# Altium project OpenBMS.PrjPcb (part 1 of 3)
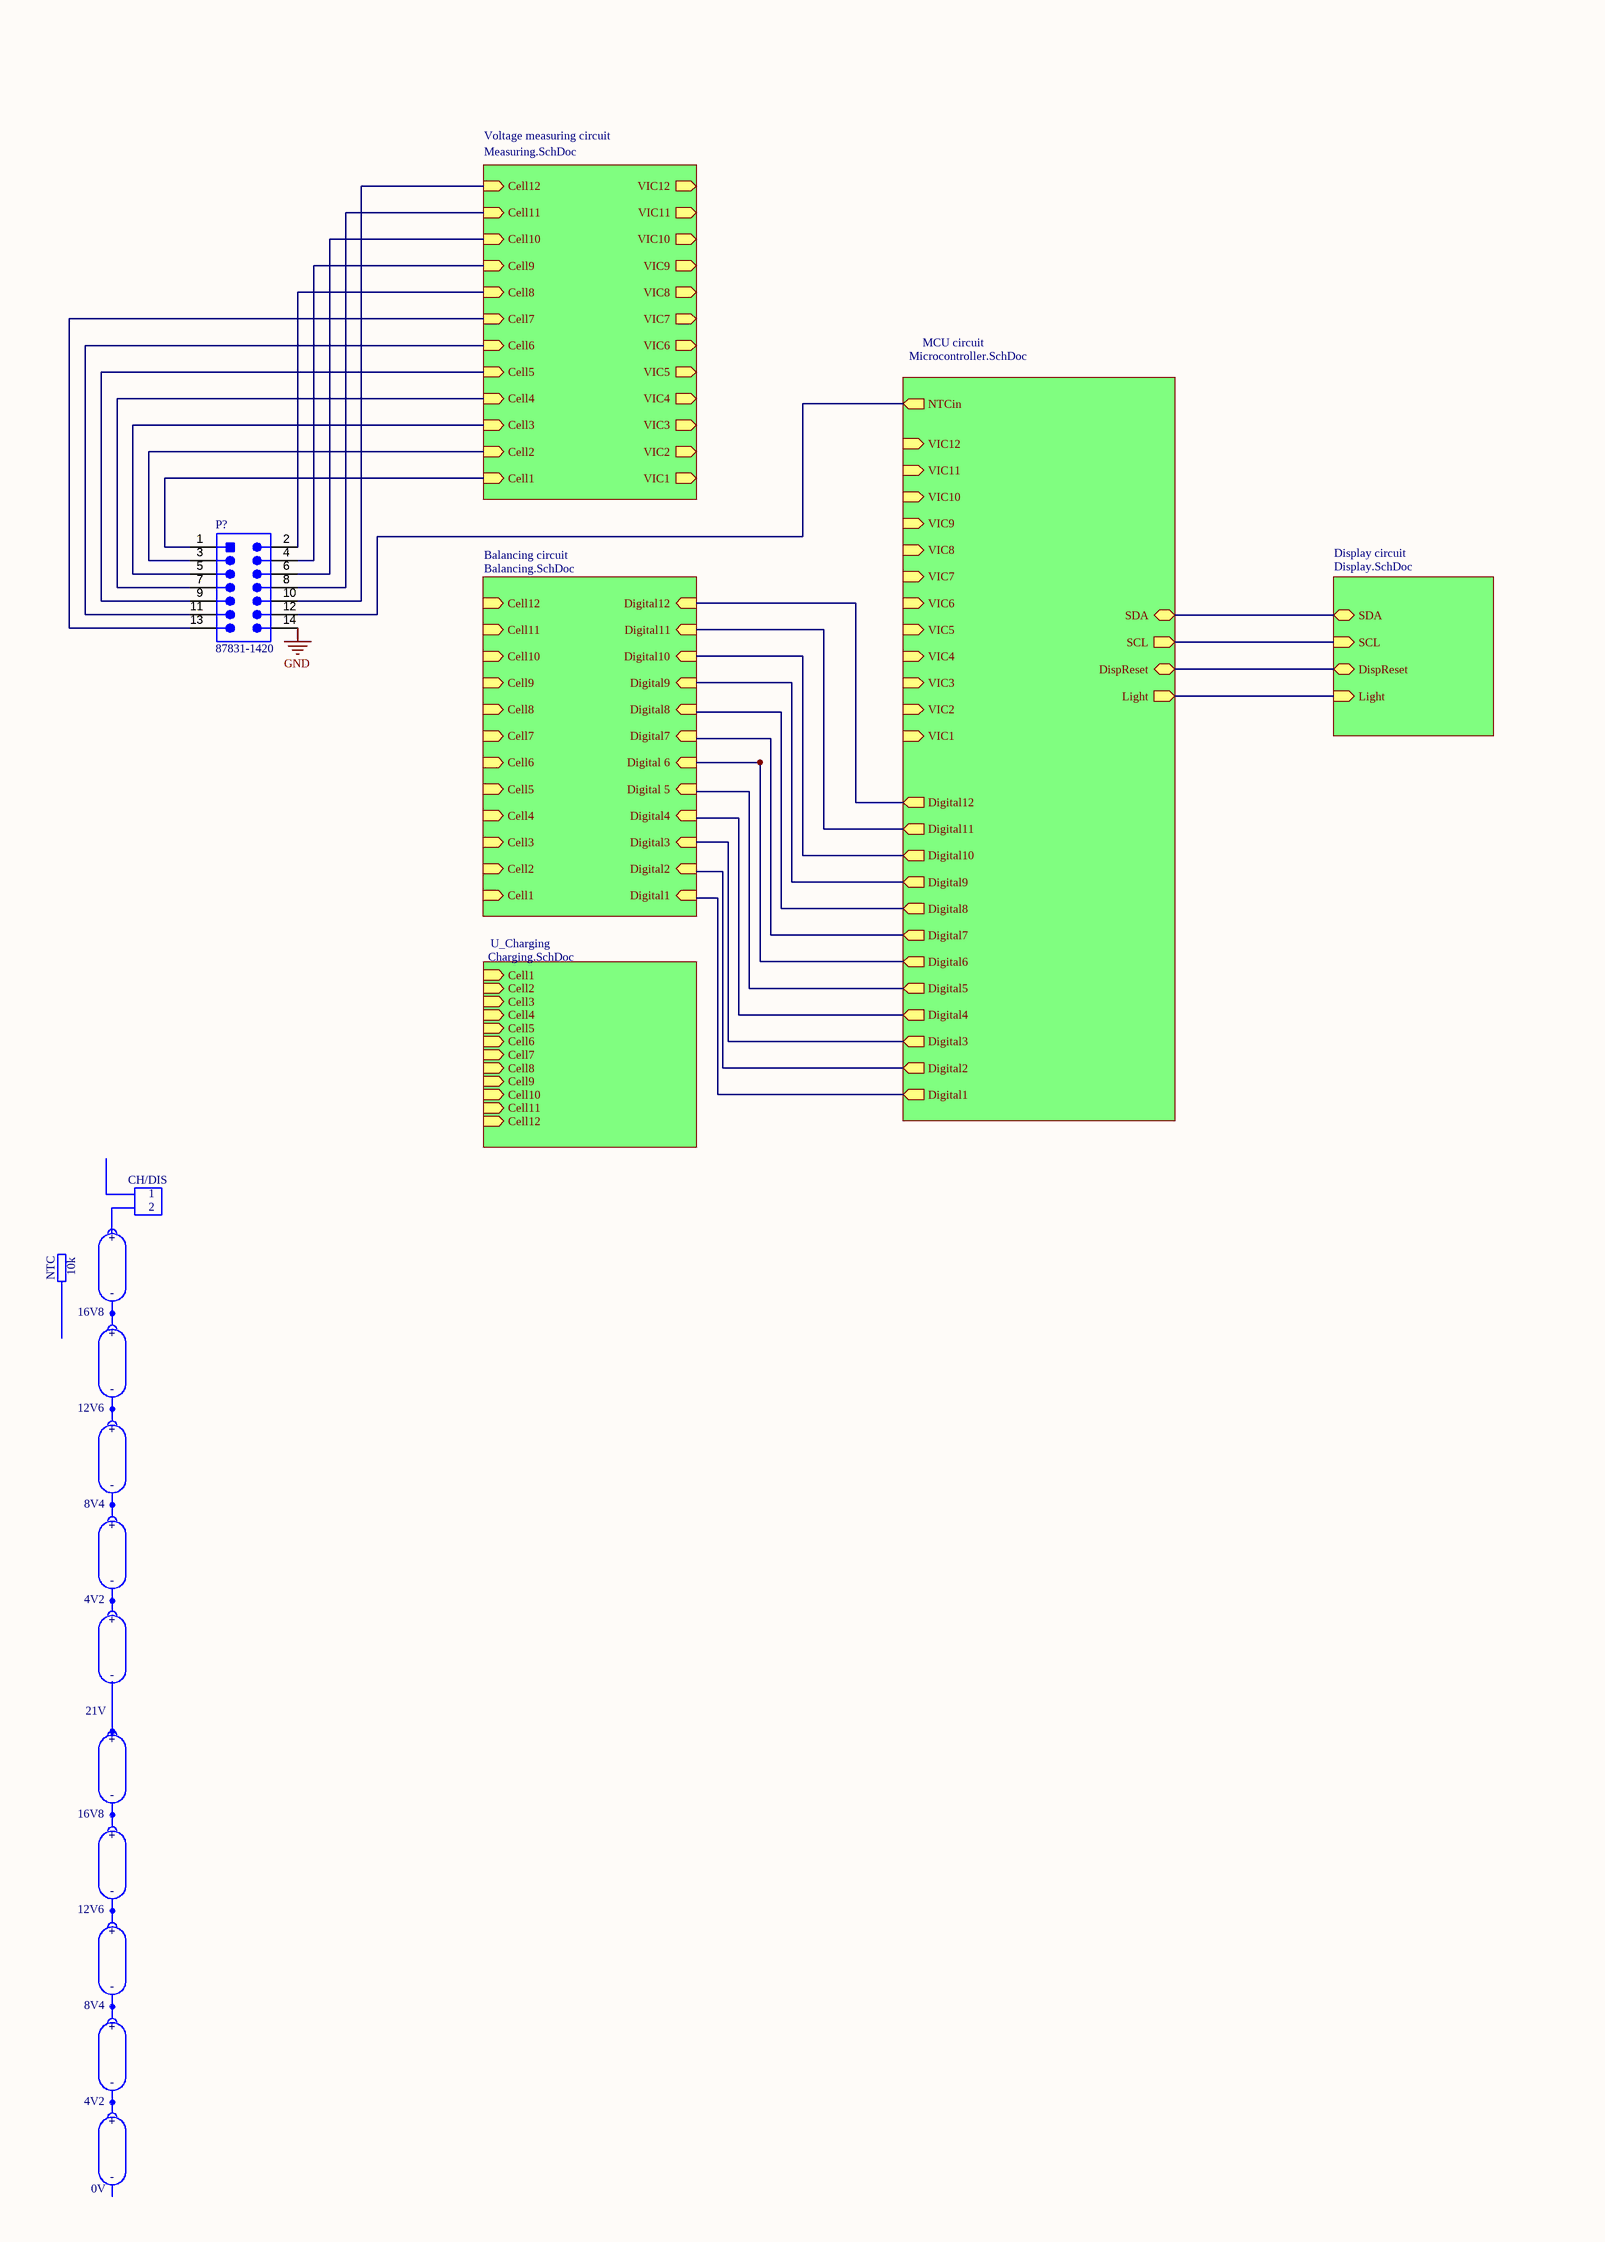
[diagram p0: OpenBMS.SchDoc]
6 sheets, 404 parts. Net scope: hierarchical (ports join the sheet entries above them; power ports are global).
Board file: OpenBMS.PcbDoc
Sheets:
  OpenBMS.SchDoc
    Balancing circuit = Balancing.SchDoc
    Voltage measuring circuit = Measuring.SchDoc
    MCU circuit = Microcontroller.SchDoc
    Display circuit = Display.SchDoc
    U_Charging = Charging.SchDoc

## Sheet OpenBMS.SchDoc: OpenBMS Parent schematic
size 299 x 420 mm; Title2: OpenBMS; Project: OpenBMS; DSN_APP_DATE: --/--/--; CHK_APP_DATE: --/--/--; ApprovedBy: 1; CheckedBy: 1; Author: Kayoum Djedidi; CompanyName: ISIMM; DrawnBy: Kayoum Djedidi; DocumentNumber: 1; Revision: 0; SheetNumber: 1; SheetTotal: 5; ImagePath: 1

### Parts
P?  87831-1420  [MOLEX-87831-1420_V]

### Sub-sheets
Balancing circuit = Balancing.SchDoc: Cell1 (in), Cell2 (in), Cell3 (in), Cell4 (in), Cell5 (in), Digital 5 (in), Digital4 (in), Digital3 (in), Digital2 (in), Digital1 (in), Cell6 (in), Digital 6 (in), Cell7 (in), Digital7 (in), Cell8 (in), Digital8 (in), Cell9 (in), Digital9 (in), Cell10 (in), Digital10 (in), Cell11 (in), Digital11 (in), Cell12 (in), Digital12 (in)
Display circuit = Display.SchDoc: Light (in), DispReset (bidir), SCL (in), SDA (bidir)
MCU circuit = Microcontroller.SchDoc: VIC5 (in), VIC4 (in), VIC3 (in), VIC2 (in), VIC1 (in), Digital5 (out), Digital4 (out), Digital3 (out), Digital2 (out), Digital1 (out), SDA (bidir), SCL (out), DispReset (bidir), Light (out), NTCin (out), Digital10 (out), Digital9 (out), Digital8 (out), Digital7 (out), Digital6 (out), VIC10 (in), VIC9 (in), VIC8 (in), VIC7 (in), VIC6 (in), VIC11 (in), VIC12 (in), Digital11 (out), Digital12 (out)
U_Charging = Charging.SchDoc: Cell1 (in), Cell2 (in), Cell3 (in), Cell4 (in), Cell5 (in), Cell6 (in), Cell7 (in), Cell8 (in), Cell9 (in), Cell10 (in), Cell11 (in), Cell12 (in)
Voltage measuring circuit = Measuring.SchDoc: Cell5 (in), Cell4 (in), Cell3 (in), Cell2 (in), Cell1 (in), VIC5 (out), VIC4 (out), VIC3 (out), VIC2 (out), VIC1 (out), Cell6 (in), VIC6 (out), Cell8 (in), Cell9 (in), Cell10 (in), Cell11 (in), VIC8 (out), VIC9 (out), VIC10 (out), VIC11 (out), Cell7 (in), Cell12 (in), VIC12 (out), VIC7 (out)

### Nets
GND: P?.14
+21V: P?.9 ; sheet Voltage measuring circuit/Cell5
NTCin: P?.12 ; sheet MCU circuit/NTCin
NetDS1_1: sheet MCU circuit/DispReset, sheet Display circuit/DispReset
NetDS1_2: sheet MCU circuit/SCL, sheet Display circuit/SCL
NetDS1_3: sheet MCU circuit/SDA, sheet Display circuit/SDA
NetMCU1_7: sheet Balancing circuit/Digital3, sheet MCU circuit/Digital3
NetMCU1_13: sheet MCU circuit/Light, sheet Display circuit/Light
NetMCU?_5: sheet Balancing circuit/Digital 6, sheet MCU circuit/Digital6
NetMCU?_8: sheet Balancing circuit/Digital9, sheet MCU circuit/Digital9
NetMCU?_9: sheet Balancing circuit/Digital10, sheet MCU circuit/Digital10
NetMCU?_10: sheet Balancing circuit/Digital11, sheet MCU circuit/Digital11
NetMCU?_11: sheet Balancing circuit/Digital12, sheet MCU circuit/Digital12
NetP?_1: P?.1 ; sheet Voltage measuring circuit/Cell1
NetP?_2: P?.2 ; sheet Voltage measuring circuit/Cell8
NetP?_3: P?.3 ; sheet Voltage measuring circuit/Cell2
NetP?_4: P?.4 ; sheet Voltage measuring circuit/Cell9
NetP?_5: P?.5 ; sheet Voltage measuring circuit/Cell3
NetP?_6: P?.6 ; sheet Voltage measuring circuit/Cell10
NetP?_7: P?.7 ; sheet Voltage measuring circuit/Cell4
NetP?_8: P?.8 ; sheet Voltage measuring circuit/Cell11
NetP?_10: P?.10 ; sheet Voltage measuring circuit/Cell12
NetP?_11: P?.11 ; sheet Voltage measuring circuit/Cell6
NetP?_13: P?.13 ; sheet Voltage measuring circuit/Cell7

### Notes on the sheet
- CH/DIS
- +
- 1
- 2
- NTC
- 16V8
- 10k
- -
- 12V6
- 8V4
- 4V2
- 21V
- 0V
- THIS DOCUMENT AND THE DATA DISCLOSED HEREIN OR
- HEREWITH IS THE PROPERTY OF ALTIUM LIMITED AND MAY
- DWG NO:
- REVISION
- REV:
- DESCRIPTION
- DATE
- APPROVED
- BE FREELY DISTRIBUTED IN WHOLE. NO RIGHTS ARE
- RESERVED OR EXPRESS OR IMPLIED WARANTEE GIVEN.
- ENG:
- APPROVALS
- PROJECT
- DSN:
- CHK:
- REFERENCE DOCUMENTS
- PROJECT REVISION:
- TITLE
- DOCUMENT REVISION:
- DESIGN ITEM:
- BOM:
- FAB DWG:
- PCB DWG:
- ASSY DWG:
- SCALE:
- A3
- SIZE
- CAGE CODE
- FILE NAME
- DWG NO.
- SHEET
- OF
- REV

### Library data of the parts
P? = CMP-2000-05240-1: Header, Pitch 2 mm, 2 x 7 Position, Height 6.4 mm, Tail Length 2.5 mm, -55 to 105 degC, RoHS, Tube; Number of Positions / Contacts: 14; Current Rating: 2A; Brand: Molex; Mounting Angle: Vertical; Pitch: 2mm; Voltage Rating: 125V; Datasheet Version: Rev. E, 04/2006; Housing Material: Thermoplastic; Contact Material: Brass; Datasheet URL: https://datasheet.ciiva.com/27096/1934585-27096088.pdf; Type: Shrouded; Number of Positions: 14; Mounting Style: ThroughHole; Product Category: Headers&WireHousings; RoHS: Details; Factory Pack Quantity: 3200; Contact Plating: Gold; Series: 87831; Number of Rows: 2; Manufacturer: Molex; Product Type: Headers; Termination Style: ThroughHole; Packaging: Tube; Tradename: Milli-Grid; Manufacturer URL: http://www.molex.com/

## Sheet Balancing.SchDoc: Cell Balancing
size 420 x 297 mm; ENG_APP_DATE: --/--/--; DSN_APP_DATE: --/--/--; CHK_APP_DATE: --/--/--
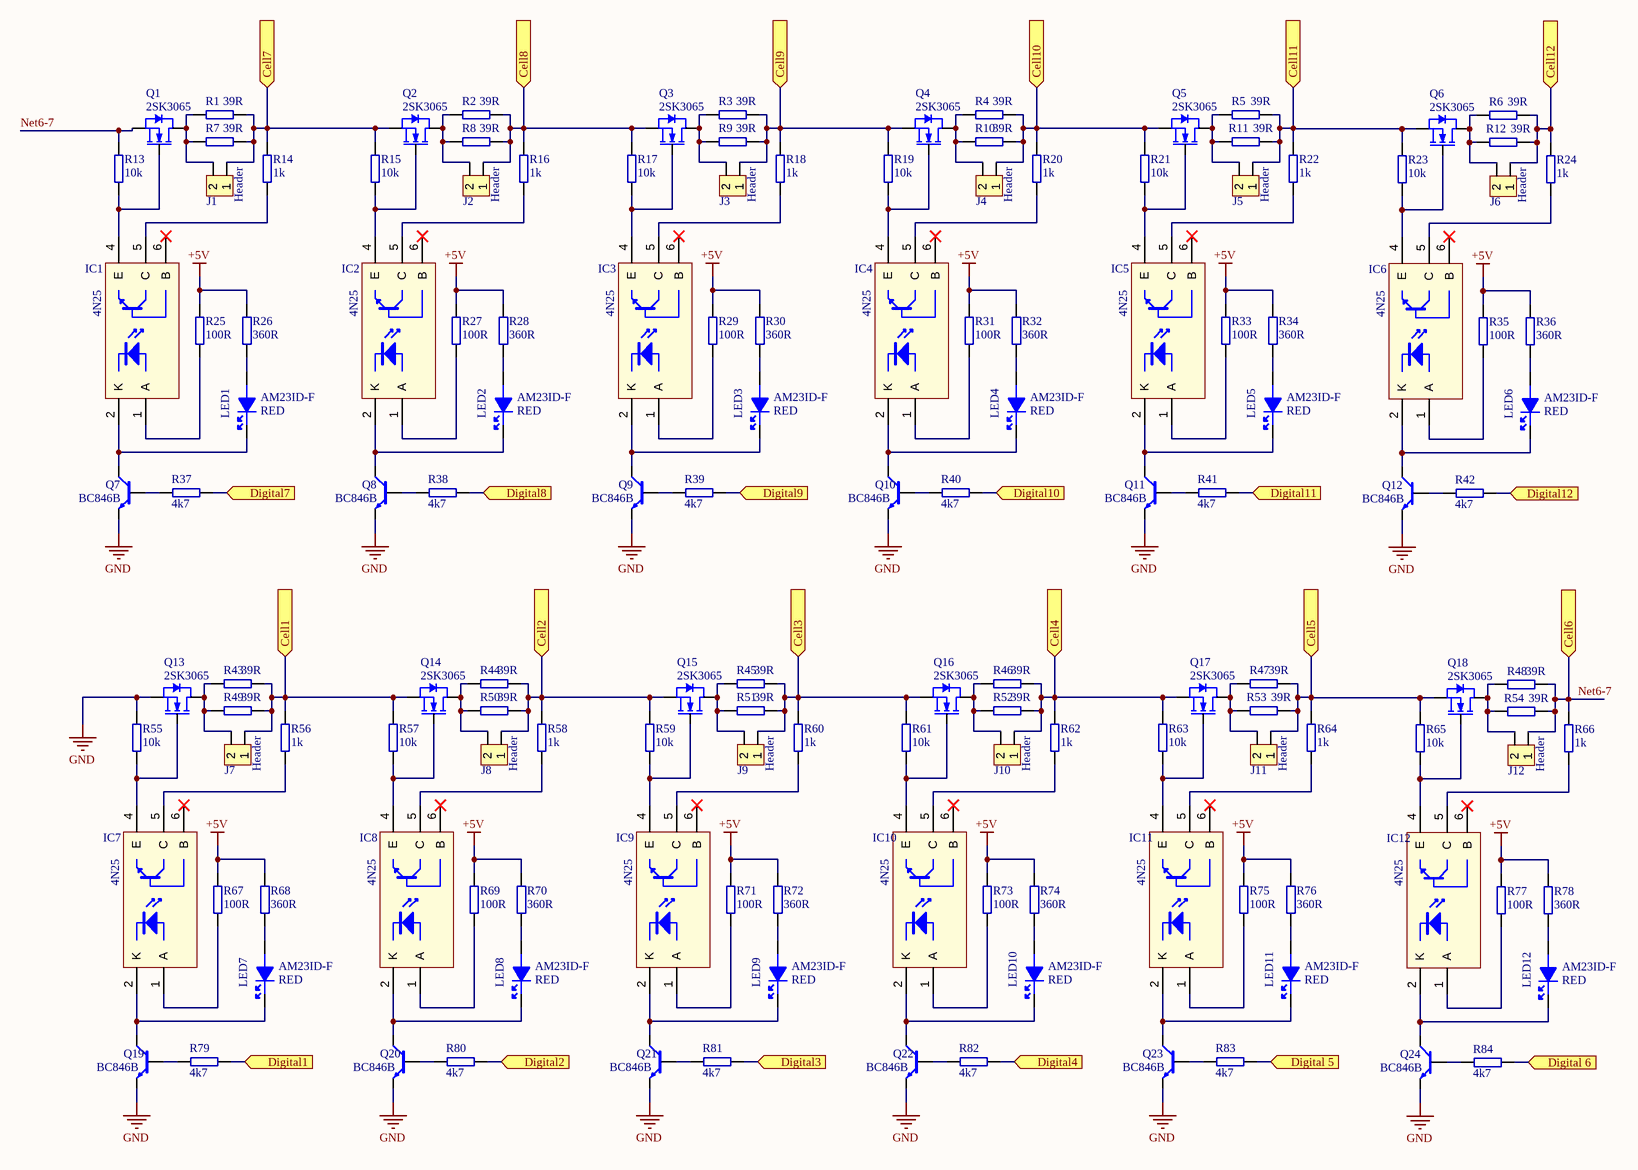
[diagram p1: Balancing.SchDoc]

### Parts
(Parts that share a designator on the sheet are numbered #1, #2 ... from top to bottom, then left to right.)
IC1  Manufacturer Part Number: 4N25  [DIP6]  (hidden comment: 4N25_DIP6)
IC2  Manufacturer Part Number: 4N25  [DIP6]  (hidden comment: 4N25_DIP6)
IC3  Manufacturer Part Number: 4N25  [DIP6]  (hidden comment: 4N25_DIP6)
IC4  Manufacturer Part Number: 4N25  [DIP6]  (hidden comment: 4N25_DIP6)
IC5  Manufacturer Part Number: 4N25  [DIP6]  (hidden comment: 4N25_DIP6)
IC6  Manufacturer Part Number: 4N25  [DIP6]  (hidden comment: 4N25_DIP6)
IC7  Manufacturer Part Number: 4N25  [DIP6]  (hidden comment: 4N25_DIP6)
IC8  Manufacturer Part Number: 4N25  [DIP6]  (hidden comment: 4N25_DIP6)
IC9  Manufacturer Part Number: 4N25  [DIP6]  (hidden comment: 4N25_DIP6)
IC10  Manufacturer Part Number: 4N25  [DIP6]  (hidden comment: 4N25_DIP6)
IC11#1  Manufacturer Part Number: 4N25  [DIP6]  (hidden comment: 4N25_DIP6)
IC12  Manufacturer Part Number: 4N25  [DIP6]  (hidden comment: 4N25_DIP6)
J1  Name: Header  [HDR_1x2_2.54mm-MALE]  (hidden comment: 2.54mm pitch)
J2  Name: Header  [HDR_1x2_2.54mm-MALE]  (hidden comment: 2.54mm pitch)
J3  Name: Header  [HDR_1x2_2.54mm-MALE]  (hidden comment: 2.54mm pitch)
J4  Name: Header  [HDR_1x2_2.54mm-MALE]  (hidden comment: 2.54mm pitch)
J5  Name: Header  [HDR_1x2_2.54mm-MALE]  (hidden comment: 2.54mm pitch)
J6  Name: Header  [HDR_1x2_2.54mm-MALE]  (hidden comment: 2.54mm pitch)
J7  Name: Header  [HDR_1x2_2.54mm-MALE]  (hidden comment: 2.54mm pitch)
J8  Name: Header  [HDR_1x2_2.54mm-MALE]  (hidden comment: 2.54mm pitch)
J9  Name: Header  [HDR_1x2_2.54mm-MALE]  (hidden comment: 2.54mm pitch)
J10  Name: Header  [HDR_1x2_2.54mm-MALE]  (hidden comment: 2.54mm pitch)
J11#1  Name: Header  [HDR_1x2_2.54mm-MALE]  (hidden comment: 2.54mm pitch)
J12#1  Name: Header  [HDR_1x2_2.54mm-MALE]  (hidden comment: 2.54mm pitch)
LED1  Name: RED  Manufacturer Part Number: AM23ID-F  [LED_SOT23]  (hidden comment: LED_SOT23)
LED2  Name: RED  Manufacturer Part Number: AM23ID-F  [LED_SOT23]  (hidden comment: LED_SOT23)
LED3  Name: RED  Manufacturer Part Number: AM23ID-F  [LED_SOT23]  (hidden comment: LED_SOT23)
LED4  Name: RED  Manufacturer Part Number: AM23ID-F  [LED_SOT23]  (hidden comment: LED_SOT23)
LED5  Name: RED  Manufacturer Part Number: AM23ID-F  [LED_SOT23]  (hidden comment: LED_SOT23)
LED6#1  Name: RED  Manufacturer Part Number: AM23ID-F  [LED_SOT23]  (hidden comment: LED_SOT23)
LED7  Name: RED  Manufacturer Part Number: AM23ID-F  [LED_SOT23]  (hidden comment: LED_SOT23)
LED8  Name: RED  Manufacturer Part Number: AM23ID-F  [LED_SOT23]  (hidden comment: LED_SOT23)
LED9  Name: RED  Manufacturer Part Number: AM23ID-F  [LED_SOT23]  (hidden comment: LED_SOT23)
LED10  Name: RED  Manufacturer Part Number: AM23ID-F  [LED_SOT23]  (hidden comment: LED_SOT23)
LED11  Name: RED  Manufacturer Part Number: AM23ID-F  [LED_SOT23]  (hidden comment: LED_SOT23)
LED12  Name: RED  Manufacturer Part Number: AM23ID-F  [LED_SOT23]  (hidden comment: LED_SOT23)
Q1  Name: 2SK3065  [N_MOSFET]  (hidden comment: 2SK3065_SOT89)
Q2  Name: 2SK3065  [N_MOSFET]  (hidden comment: 2SK3065_SOT89)
Q3  Name: 2SK3065  [N_MOSFET]  (hidden comment: 2SK3065_SOT89)
Q4  Name: 2SK3065  [N_MOSFET]  (hidden comment: 2SK3065_SOT89)
Q5  Name: 2SK3065  [N_MOSFET]  (hidden comment: 2SK3065_SOT89)
Q6  Name: 2SK3065  [N_MOSFET]  (hidden comment: 2SK3065_SOT89)
Q7  Name: BC846B  [NPN_BJT_SOT23]  (hidden comment: BC846B_SOT23)
Q8  Name: BC846B  [NPN_BJT_SOT23]  (hidden comment: BC846B_SOT23)
Q9  Name: BC846B  [NPN_BJT_SOT23]  (hidden comment: BC846B_SOT23)
Q10  Name: BC846B  [NPN_BJT_SOT23]  (hidden comment: BC846B_SOT23)
Q11#1  Name: BC846B  [NPN_BJT_SOT23]  (hidden comment: BC846B_SOT23)
Q12  Name: BC846B  [NPN_BJT_SOT23]  (hidden comment: BC846B_SOT23)
Q13  Name: 2SK3065  [N_MOSFET]  (hidden comment: 2SK3065_SOT89)
Q14  Name: 2SK3065  [N_MOSFET]  (hidden comment: 2SK3065_SOT89)
Q15  Name: 2SK3065  [N_MOSFET]  (hidden comment: 2SK3065_SOT89)
Q16  Name: 2SK3065  [N_MOSFET]  (hidden comment: 2SK3065_SOT89)
Q17  Name: 2SK3065  [N_MOSFET]  (hidden comment: 2SK3065_SOT89)
Q18  Name: 2SK3065  [N_MOSFET]  (hidden comment: 2SK3065_SOT89)
Q19  Name: BC846B  [NPN_BJT_SOT23]  (hidden comment: BC846B_SOT23)
Q20  Name: BC846B  [NPN_BJT_SOT23]  (hidden comment: BC846B_SOT23)
Q21  Name: BC846B  [NPN_BJT_SOT23]  (hidden comment: BC846B_SOT23)
Q22  Name: BC846B  [NPN_BJT_SOT23]  (hidden comment: BC846B_SOT23)
Q23  Name: BC846B  [NPN_BJT_SOT23]  (hidden comment: BC846B_SOT23)
Q24  Name: BC846B  [NPN_BJT_SOT23]  (hidden comment: BC846B_SOT23)
R1  Name: 39R  [R_2512]  (hidden comment: 39R_2W)
R2  Name: 39R  [R_2512]  (hidden comment: 39R_2W)
R3  Name: 39R  [R_2512]  (hidden comment: 39R_2W)
R4  Name: 39R  [R_2512]  (hidden comment: 39R_2W)
R5  Name: 39R  [R_2512]  (hidden comment: 39R_2W)
R6  Name: 39R  [R_2512]  (hidden comment: 39R_2W)
R7  Name: 39R  [R_2512]  (hidden comment: 39R_2W)
R8  Name: 39R  [R_2512]  (hidden comment: 39R_2W)
R9  Name: 39R  [R_2512]  (hidden comment: 39R_2W)
R10  Name: 39R  [R_2512]  (hidden comment: 39R_2W)
R11  Name: 39R  [R_2512]  (hidden comment: 39R_2W)
R12  Name: 39R  [R_2512]  (hidden comment: 39R_2W)
R13  Name: 10k  [R_0805]  (hidden comment: 10k_125mW)
R14  Name: 1k  [R_0805]  (hidden comment: 1k_125mW)
R15  Name: 10k  [R_0805]  (hidden comment: 10k_125mW)
R16  Name: 1k  [R_0805]  (hidden comment: 1k_125mW)
R17  Name: 10k  [R_0805]  (hidden comment: 10k_125mW)
R18  Name: 1k  [R_0805]  (hidden comment: 1k_125mW)
R19  Name: 10k  [R_0805]  (hidden comment: 10k_125mW)
R20  Name: 1k  [R_0805]  (hidden comment: 1k_125mW)
R21  Name: 10k  [R_0805]  (hidden comment: 10k_125mW)
R22  Name: 1k  [R_0805]  (hidden comment: 1k_125mW)
R23  Name: 10k  [R_0805]  (hidden comment: 10k_125mW)
R24  Name: 1k  [R_0805]  (hidden comment: 1k_125mW)
R25  Name: 100R  [R_0805]  (hidden comment: 100R_500mW)
R26  Name: 360R  [R_0805]  (hidden comment: 360R_125mW)
R27  Name: 100R  [R_0805]  (hidden comment: 100R_500mW)
R28  Name: 360R  [R_0805]  (hidden comment: 360R_125mW)
R29  Name: 100R  [R_0805]  (hidden comment: 100R_500mW)
R30  Name: 360R  [R_0805]  (hidden comment: 360R_125mW)
R31  Name: 100R  [R_0805]  (hidden comment: 100R_500mW)
R32  Name: 360R  [R_0805]  (hidden comment: 360R_125mW)
R33  Name: 100R  [R_0805]  (hidden comment: 100R_500mW)
R34  Name: 360R  [R_0805]  (hidden comment: 360R_125mW)
R35  Name: 100R  [R_0805]  (hidden comment: 100R_500mW)
R36  Name: 360R  [R_0805]  (hidden comment: 360R_125mW)
R37  Name: 4k7  [R_0805]  (hidden comment: 4k7_125mW)
R38  Name: 4k7  [R_0805]  (hidden comment: 4k7_125mW)
R39  Name: 4k7  [R_0805]  (hidden comment: 4k7_125mW)
R40  Name: 4k7  [R_0805]  (hidden comment: 4k7_125mW)
R41  Name: 4k7  [R_0805]  (hidden comment: 4k7_125mW)
R42  Name: 4k7  [R_0805]  (hidden comment: 4k7_125mW)
R43  Name: 39R  [R_2512]  (hidden comment: 39R_2W)
R44  Name: 39R  [R_2512]  (hidden comment: 39R_2W)
R45  Name: 39R  [R_2512]  (hidden comment: 39R_2W)
R46  Name: 39R  [R_2512]  (hidden comment: 39R_2W)
R47  Name: 39R  [R_2512]  (hidden comment: 39R_2W)
R48  Name: 39R  [R_2512]  (hidden comment: 39R_2W)
R49  Name: 39R  [R_2512]  (hidden comment: 39R_2W)
R50  Name: 39R  [R_2512]  (hidden comment: 39R_2W)
R51  Name: 39R  [R_2512]  (hidden comment: 39R_2W)
R52  Name: 39R  [R_2512]  (hidden comment: 39R_2W)
R53  Name: 39R  [R_2512]  (hidden comment: 39R_2W)
R54  Name: 39R  [R_2512]  (hidden comment: 39R_2W)
R55  Name: 10k  [R_0805]  (hidden comment: 10k_125mW)
R56  Name: 1k  [R_0805]  (hidden comment: 1k_125mW)
R57  Name: 10k  [R_0805]  (hidden comment: 10k_125mW)
R58  Name: 1k  [R_0805]  (hidden comment: 1k_125mW)
R59  Name: 10k  [R_0805]  (hidden comment: 10k_125mW)
R60  Name: 1k  [R_0805]  (hidden comment: 1k_125mW)
R61  Name: 10k  [R_0805]  (hidden comment: 10k_125mW)
R62#1  Name: 1k  [R_0805]  (hidden comment: 1k_125mW)
R63#1  Name: 10k  [R_0805]  (hidden comment: 10k_125mW)
R64#1  Name: 1k  [R_0805]  (hidden comment: 1k_125mW)
R65#1  Name: 10k  [R_0805]  (hidden comment: 10k_125mW)
R66#1  Name: 1k  [R_0805]  (hidden comment: 1k_125mW)
R67#1  Name: 100R  [R_0805]  (hidden comment: 100R_500mW)
R68#1  Name: 360R  [R_0805]  (hidden comment: 360R_125mW)
R69  Name: 100R  [R_0805]  (hidden comment: 100R_500mW)
R70  Name: 360R  [R_0805]  (hidden comment: 360R_125mW)
R71  Name: 100R  [R_0805]  (hidden comment: 100R_500mW)
R72  Name: 360R  [R_0805]  (hidden comment: 360R_125mW)
R73  Name: 100R  [R_0805]  (hidden comment: 100R_500mW)
R74  Name: 360R  [R_0805]  (hidden comment: 360R_125mW)
R75  Name: 100R  [R_0805]  (hidden comment: 100R_500mW)
R76  Name: 360R  [R_0805]  (hidden comment: 360R_125mW)
R77  Name: 100R  [R_0805]  (hidden comment: 100R_500mW)
R78  Name: 360R  [R_0805]  (hidden comment: 360R_125mW)
R79  Name: 4k7  [R_0805]  (hidden comment: 4k7_125mW)
R80  Name: 4k7  [R_0805]  (hidden comment: 4k7_125mW)
R81  Name: 4k7  [R_0805]  (hidden comment: 4k7_125mW)
R82  Name: 4k7  [R_0805]  (hidden comment: 4k7_125mW)
R83  Name: 4k7  [R_0805]  (hidden comment: 4k7_125mW)
R84  Name: 4k7  [R_0805]  (hidden comment: 4k7_125mW)

### Ports
Cell1 (in), Cell2 (in), Cell3 (in), Cell4 (in), Cell5 (in), Cell6 (in), Cell7 (in), Cell8 (in), Cell9 (in), Cell10 (in), Cell11 (in), Cell12 (in), Digital1 (in), Digital2 (in), Digital3 (in), Digital4 (in), Digital7 (in), Digital8 (in), Digital9 (in), Digital10 (in), Digital11 (in), Digital12 (in), Digital 5 (in), Digital 6 (in)

### Nets
+5V: R25.2 R26.1 R27.1 R28.1 R29.1 R30.1 R31.1 R32.1 R33.1 R34.1 R35.1 R36.1 R67#1.2 R68#1.1 R69.1 R70.1 R71.1 R72.1 R73.1 R74.1 R75.1 R76.1 R77.1 R78.1
GND: Q7.3(E) Q8.3(E) Q9.3(E) Q10.3(E) Q11#1.3(E) Q12.3(E) Q13.3(S) Q19.3(E) Q20.3(E) Q21.3(E) Q22.3(E) Q23.3(E) Q24.3(E) R55.1
Net6-7: J12#1.1 Q1.3(S) R13.1 R48.1 R54.1 R66#1.1 ; port Cell6
NetIC1_1: IC1.1(A) R25.1
NetIC1_2: IC1.2(K) LED1.3(K) Q7.1(C)
NetIC1_4: IC1.4(E) Q1.1(G) R13.2
NetIC1_5: IC1.5(C) R14.2
NetIC2_1: IC2.1(A) R27.2
NetIC2_2: IC2.2(K) LED2.3(K) Q8.1(C)
NetIC2_4: IC2.4(E) Q2.1(G) R15.2
NetIC2_5: IC2.5(C) R16.2
NetIC3_1: IC3.1(A) R29.2
NetIC3_2: IC3.2(K) LED3.3(K) Q9.1(C)
NetIC3_4: IC3.4(E) Q3.1(G) R17.2
NetIC3_5: IC3.5(C) R18.2
NetIC4_1: IC4.1(A) R31.2
NetIC4_2: IC4.2(K) LED4.3(K) Q10.1(C)
NetIC4_4: IC4.4(E) Q4.1(G) R19.2
NetIC4_5: IC4.5(C) R20.2
NetIC5_1: IC5.1(A) R33.2
NetIC5_2: IC5.2(K) LED5.3(K) Q11#1.1(C)
NetIC5_4: IC5.4(E) Q5.1(G) R21.2
NetIC5_5: IC5.5(C) R22.2
NetIC6_1: IC6.1(A) R35.2
NetIC6_2: IC6.2(K) LED6#1.3(K) Q12.1(C)
NetIC6_4: IC6.4(E) Q6.1(G) R23.2
NetIC6_5: IC6.5(C) R24.2
NetIC7_1: IC7.1(A) R67#1.1
NetIC7_2: IC7.2(K) LED7.3(K) Q19.1(C)
NetIC7_4: IC7.4(E) Q13.1(G) R55.2
NetIC7_5: IC7.5(C) R56.2
NetIC8_1: IC8.1(A) R69.2
NetIC8_2: IC8.2(K) LED8.3(K) Q20.1(C)
NetIC8_4: IC8.4(E) Q14.1(G) R57.2
NetIC8_5: IC8.5(C) R58.2
NetIC9_1: IC9.1(A) R71.2
NetIC9_2: IC9.2(K) LED9.3(K) Q21.1(C)
NetIC9_4: IC9.4(E) Q15.1(G) R59.2
NetIC9_5: IC9.5(C) R60.2
NetIC10_1: IC10.1(A) R73.2
NetIC10_2: IC10.2(K) LED10.3(K) Q22.1(C)
NetIC10_4: IC10.4(E) Q16.1(G) R61.2
NetIC10_5: IC10.5(C) R62#1.2
NetIC11#1_1: IC11#1.1(A) R75.2
NetIC11#1_2: IC11#1.2(K) LED11.3(K) Q23.1(C)
NetIC11#1_4: IC11#1.4(E) Q17.1(G) R63#1.2
NetIC11#1_5: IC11#1.5(C) R64#1.2
NetIC12_1: IC12.1(A) R77.2
NetIC12_2: IC12.2(K) LED12.3(K) Q24.1(C)
NetIC12_4: IC12.4(E) Q18.1(G) R65#1.2
NetIC12_5: IC12.5(C) R66#1.2
NetJ1_1: J1.1 Q2.3(S) R1.1 R7.1 R14.1 R15.1 ; port Cell7
NetJ1_2: J1.2 Q1.2(D) R1.2 R7.2
NetJ2_1: J2.1 Q3.3(S) R2.1 R8.1 R16.1 R17.1 ; port Cell8
NetJ2_2: J2.2 Q2.2(D) R2.2 R8.2
NetJ3_1: J3.1 Q4.3(S) R3.1 R9.1 R18.1 R19.1 ; port Cell9
NetJ3_2: J3.2 Q3.2(D) R3.2 R9.2
NetJ4_1: J4.1 Q5.3(S) R4.1 R10.1 R20.1 R21.1 ; port Cell10
NetJ4_2: J4.2 Q4.2(D) R4.2 R10.2
NetJ5_1: J5.1 R5.1 R11.1 R22.1 ; port Cell11
NetJ5_2: J5.2 Q5.2(D) R5.2 R11.2
NetJ6_1: J6.1 R6.1 R12.1 R24.1 ; port Cell12
NetJ6_2: J6.2 Q6.2(D) R6.2 R12.2
NetJ7_1: J7.1 Q14.3(S) R43.1 R49.1 R56.1 R57.1 ; port Cell1
NetJ7_2: J7.2 Q13.2(D) R43.2 R49.2
NetJ8_1: J8.1 Q15.3(S) R44.1 R50.1 R58.1 R59.1 ; port Cell2
NetJ8_2: J8.2 Q14.2(D) R44.2 R50.2
NetJ9_1: J9.1 Q16.3(S) R45.1 R51.1 R60.1 R61.1 ; port Cell3
NetJ9_2: J9.2 Q15.2(D) R45.2 R51.2
NetJ10_1: J10.1 Q17.3(S) R46.1 R52.1 R62#1.1 R63#1.1 ; port Cell4
NetJ10_2: J10.2 Q16.2(D) R46.2 R52.2
NetJ11#1_1: J11#1.1 R47.1 R53.1 R64#1.1 ; port Cell5
NetJ11#1_2: J11#1.2 Q17.2(D) R47.2 R53.2
NetJ12#1_2: J12#1.2 Q18.2(D) R48.2 R54.2
NetLED1_1: LED1.1(A) R26.2
NetLED2_1: LED2.1(A) R28.2
NetLED3_1: LED3.1(A) R30.2
NetLED4_1: LED4.1(A) R32.2
NetLED5_1: LED5.1(A) R34.2
NetLED6#1_1: LED6#1.1(A) R36.2
NetLED7_1: LED7.1(A) R68#1.2
NetLED8_1: LED8.1(A) R70.2
NetLED9_1: LED9.1(A) R72.2
NetLED10_1: LED10.1(A) R74.2
NetLED11_1: LED11.1(A) R76.2
NetLED12_1: LED12.1(A) R78.2
NetMCU1_7: R81.2 ; port Digital3
NetMCU?_5: R84.2 ; port Digital 6
NetMCU?_8: R39.2 ; port Digital9
NetMCU?_9: R40.1 ; port Digital10
NetMCU?_10: R41.2 ; port Digital11
NetMCU?_11: R42.2 ; port Digital12
NetQ6_3: Q6.3(S) R23.1
NetQ7_2: Q7.2(B) R37.2
NetQ8_2: Q8.2(B) R38.2
NetQ9_2: Q9.2(B) R39.1
NetQ10_2: Q10.2(B) R40.2
NetQ11#1_2: Q11#1.2(B) R41.1
NetQ12_2: Q12.2(B) R42.1
NetQ18_3: Q18.3(S) R65#1.1
NetQ19_2: Q19.2(B) R79.2
NetQ20_2: Q20.2(B) R80.2
NetQ21_2: Q21.2(B) R81.1
NetQ22_2: Q22.2(B) R82.2
NetQ23_2: Q23.2(B) R83.1
NetQ24_2: Q24.2(B) R84.1
NetR37_1: R37.1 ; port Digital7
NetR38_1: R38.1 ; port Digital8
NetR79_1: R79.1 ; port Digital1
NetR80_1: R80.1 ; port Digital2
NetR82_1: R82.1 ; port Digital4
NetR83_2: R83.2 ; port Digital 5

Not connected (* = marked no-connect by the designer): IC1 6(B)*; IC2 6(B)*; IC3 6(B)*; IC4 6(B)*; IC5 6(B)*; IC6 6(B)*; IC7 6(B)*; IC8 6(B)*; IC9 6(B)*; IC10 6(B)*; IC11#1 6(B)*; IC12 6(B)*

### Notes on the sheet
- THIS DOCUMENT AND THE DATA DISCLOSED HEREIN OR
- HEREWITH IS THE PROPERTY OF ALTIUM LIMITED AND MAY
- DWG NO:
- REVISION
- REV:
- DESCRIPTION
- DATE
- APPROVED
- BE FREELY DISTRIBUTED IN WHOLE. NO RIGHTS ARE
- RESERVED OR EXPRESS OR IMPLIED WARANTEE GIVEN.
- ENG:
- APPROVALS
- PROJECT
- DSN:
- CHK:
- REFERENCE DOCUMENTS
- PROJECT REVISION:
- TITLE
- DOCUMENT REVISION:
- DESIGN ITEM:
- BOM:
- FAB DWG:
- PCB DWG:
- ASSY DWG:
- SCALE:
- A3
- SIZE
- CAGE CODE
- FILE NAME
- DWG NO.
- SHEET
- OF
- REV

### Library data of the parts
IC1-IC10 IC11#1 IC12 = 4N25_DIP6: Optocoupler [TH]; Manufacturer: Vishay Semiconductors; Max Power Dissipation: 150mW; Number of Elements: 1; Collector Emitter Voltage (VCEO): 30V; Rise Time: 2s; Isolation Voltage: 5kV; Forward Voltage: 1.5V; Forward Current: 60mA; Collector Emitter Saturation Voltage: 500mV; Reverse Breakdown Voltage: 5V; Output Voltage: 70V; Output Current per Channel: 50mA; Max Collector Current: 100mA; Current Transfer Ratio: 50%; Approvals: UL; Supplier 1: Mouser; RoHS: Yes; Mount: Through Hole; Case/Package: DIP-6; Number of Pins: 6; Contact Plating: Tin; Min Operating Temperature: -55°C; Max Operating Temperature: 100°C; Packaging: Rail/Tube; Package Quantity: 2000; Power Dissipation: 150mW; Number of Channels: 1; Max Input Current: 60mA; Max Output Voltage: 30V; Fall Time: 2s; Input Current: 50mA; Collector Emitter Breakdown Voltage: 30V; Radiation Hardening: No; Lead Free: Lead Free; REACH SVHC: Unknown; ComponentLink1URL: https://hr.mouser.com/datasheet/2/427/VISHS81804_1-2566401.pdf; ComponentLink1Description: DATASHEET; ComponentLink3URL: https://hr.mouser.com/ProductDetail/Vishay-Semiconductors/4N25?qs=8Ee2Dc0%2F0IdkAlKrFkNMCA%3D%3D; ComponentLink3Description: BUY; Supplier Part Number 1: 78-4N25
J1-J10 J11#1 J12#1 = Header 1x2: Header, 2-Pin [TH]; Manufacturer: Molex; Current Rating: 4A; Gender: Male; Glow Wire Compliant: Non-compliant; Number of Circuits: 15; Pitch: 0.1inch; Voltage Rating: 250V; Connector Type: Male Pin; LatestRevisionDate: 17-Jul-2002; LatestRevisionNote: Re-released for DXP Platform.; Publisher: Altium Limited; ComponentLink1Description: DATASHEET; ComponentLink1URL: https://hr.mouser.com/datasheet/2/276/0022284150_PCB_HEADERS-159054.pdf; ComponentLink2Description: BUY; ComponentLink2URL: https://hr.mouser.com/ProductDetail/Molex/22-28-4150?qs=M5Ic86%252BuP8aClMFgmZrq7g%3D%3D; Supplier 1: Mouser; Supplier Part Number 1: 538-22-28-4150; Color: Black; Contact Material: Brass; Contact Mating Length: 0.24inch; Contact Plating: Tin; Contact Type: Male Pin; Flammability Rating: UL94 V-0; Height: 2.29mm; Housing Color: Black; Housing Material: Thermoplastic; Lead Free: Contains Lead; Length: 38.1mm; Mount: Through Hole; Number of Contacts: 15; Number of Positions: 15; Number of Rows: 1; Orientation: Vertical; Package Quantity: 1; Packaging: Bulk; RoHS Compliant: Yes; Series: KK® 42375; Termination: Solder; Voltage Rating (DC): 250V; Width: 2.49mm; Supplier Packaging 1: Bulk; Supplier Unit Price 1: $0.57; Supplier Location 1: US; Manufacturer Part Number: 22-28-4150
LED1-LED5 LED6#1 LED7-LED12 = LED_SOT23: Red LED [SMD]; Manufacturer: Kingbright; Dominant Wavelength: 617nm; Forward Current: 20mA; Forward Voltage: 2V; Lens Style: Diffused,Tinted; Lens Transparency: Diffused; Luminous Intensity: 7mcd; Power Rating: 75mW; Viewing Angle: 140°; Wavelength: 625nm; ComponentLink1Description: DATASHEET; ComponentLink1URL: https://hr.mouser.com/datasheet/2/216/AM23ID-F-33364.pdf; ComponentLink2Description: BUY; ComponentLink2URL: https://hr.mouser.com/ProductDetail/Kingbright/AM23ID-F?qs=y3UkhjaxUTbVf8YFp%2FiekA%3D%3D; Supplier 1: Mouser; Supplier Part Number 1: 604-AM23ID-F; Case/Package: SOT-23; Color: Red; Height: 1.2mm; Illumination Color: Red; Lead Free: Lead Free; Length: 3mm; Lens Color: Red; Max Operating Temperature: 85°C; Min Operating Temperature: -40°C; Mount: Surface Mount; Package Quantity: 2000; Packaging: Tape and Reel; RoHS Compliant: Yes; Series: -; Test Current: 20mA; Width: 1.3mm; Supplier Packaging 1: Tape & Reel; Supplier Unit Price 1: $0.50; Supplier Location 1: US
Q1-Q6 Q13-Q18 = 2SK3065_SOT89: N Channel MOSFET [SMD]; Manufacturer_Part_Number: 2SK3065T100; Manufacturer: Rohm; Vendor: ROHM Semiconductor; Built_By: EMA_Matt; SourceLibrary: Rohm_2019-09-23; Type: DEV; Continuous Drain Current (ID): 2A; Drain to Source Breakdown Voltage: 60V; Drain to Source Resistance: 350mR; Element Configuration: Single; Fall Time: 70ns; Gate to Source Voltage (Vgs): 20V; Input Capacitance: 160pF; Max Power Dissipation: 500mW; Nominal Vgs: 800mV; On-State Resistance: 450mR; Power Dissipation: 2W; Rds On Max: 320mR; Rise Time: 50ns; Turn-Off Delay Time: 120ns; Turn-On Delay Time: 20ns; Copyright: Copyright (C) 2018 Accelerated Designs. All rights reserved; RefDes: RefDes; Value: Value; ComponentLink1Description: DATASHEET; ComponentLink1URL: https://hr.mouser.com/datasheet/2/348/rohm_semiconductor_rohms30086-1-1742632.pdf; ComponentLink2Description: BUY; ComponentLink2URL: https://hr.mouser.com/ProductDetail/ROHM-Semiconductor/2SK3065T100?qs=4kLU8WoGk0uDb4MT5MWZbg%3D%3D; Supplier 1: Mouser; Supplier Part Number 1: 755-2SK3065T100; Case/Package: SOT-89; Current Rating: 2A; Drain to Source Voltage (Vdss): 60V; Lead Free: Lead Free; Max Operating Temperature: 150°C; Min Operating Temperature: -55°C; Mount: Surface Mount; Number of Pins: 3; Package Quantity: 1000; Packaging: Tape and Reel; Radiation Hardening: No; REACH SVHC: No SVHC; RoHS Compliant: Yes; Threshold Voltage: 800mV; Voltage Rating (DC): 60V; Supplier Packaging 1: Tape & Reel; Supplier Unit Price 1: $0.68; Supplier Location 1: US; Manufacturer Part Number: 2SK3065T100
Q7-Q10 Q11#1 Q12 Q19-Q24 = BC846B_SOT23: NPN transistor [SMD]; Manufacturer Part Number: BC846ALT1G; Manufacturer: ON Semiconductor; Collector Base Voltage (VCBO): 80V; Collector Emitter Breakdown Voltage: 65V; Collector Emitter Saturation Voltage: 600mV; Current Rating: 100mA; Element Configuration: Single; Emitter Base Voltage (VEBO): 6V; Frequency: 100MHz; hFE Min: 110; Max Power Dissipation: 300mW; Number of Elements: 1; ComponentLink1Description: DATASHEET; ComponentLink1URL: https://hr.mouser.com/datasheet/2/308/1/BC846ALT1_D-2310268.pdf; ComponentLink2Description: BUY; ComponentLink2URL: https://hr.mouser.com/ProductDetail/onsemi/BC846ALT1G?qs=vNc2DXHODiKaYXYnVvJi5w%3D%3D; Case/Package: SOT-23; Collector Emitter Voltage (VCEO): 65V; Collector-emitter Voltage-Max: 600mV; Contact Plating: Tin,Matte; Gain Bandwidth Product: 100MHz; Halogen Free: Halogen Free; Height: 0.94mm; Lead Free: Lead Free; Length: 2.9mm; Max Breakdown Voltage: 65V; Max Collector Current: 100mA; Max Frequency: 100MHz; Max Operating Temperature: 150°C; Min Operating Temperature: -55°C; Number of Pins: 3; Package Quantity: 1; Packaging: Tape and Reel; Polarity: NPN; Power Dissipation: 300mW; Radiation Hardening: No; REACH SVHC: No SVHC; RoHS Compliant: Yes; Series: BC846AL; Transition Frequency: 100MHz; Voltage Rating (DC): 65V; Width: 1.3mm; Supplier 1: Mouser; Supplier Part Number 1: 863-BC846ALT1G
R1-R12 R43-R54 = R_39R_2512: Resistor [SMD]; Manufacturer: TE Connectivity; Manufacturer Part Number: CRGP2512F39R; Max Power Dissipation: 2W; Temperature Coefficient: 200ppm/°C; Tolerance: 1%; ComponentLink1Description: DATASHEET; ComponentLink1URL: https://hr.mouser.com/datasheet/2/418/8/ENG_DS_9_1773463_9_B-1358566.pdf; ComponentLink2Description: BUY; ComponentLink2URL: https://hr.mouser.com/ProductDetail/TE-Connectivity-Holsworthy/CRGP2512F39R?qs=sGAEpiMZZMtlubZbdhIBIOInyB5Ysv8sHnBniE7kULc%3D; Supplier 1: Mouser; Supplier Part Number 1: 279-CRGP2512F39R; Case/Package: 2512; Max Operating Temperature: 155°C; Min Operating Temperature: -55°C; Number of Terminations: 2; Packaging: Cut Tape; Resistance: 39R; Resistor Type: Thick Film; RoHS Compliant: Yes; Supplier Unit Price 1: $0.57; Supplier Location 1: US
R13 R15 R17 R19 R21 R23 R55 R57 R59 R61 R63#1 R65#1 = R_10k_0805: Resistor [SMD]; Manufacturer: Vishay; Manufacturer Part Number: CRCW080510K0FKEAC; Power Rating: 125mW; Resistance: 10000R; Tolerance: 1%; ComponentLink1Description: DATASHEET; ComponentLink1URL: https://hr.mouser.com/datasheet/2/427/crcwce3-1762584.pdf; ComponentLink2Description: BUY; ComponentLink2URL: https://hr.mouser.com/ProductDetail/Vishay-Dale/CRCW080510K0FKEAC?qs=E3Y5ESvWgWORadmUijPtxQ%3D%3D; Supplier 1: Mouser; Supplier Part Number 1: 71-CRCW080510K0FKEAC; Case/Package: 0805; Lead Free: Lead Free; RoHS Compliant: Yes; Supplier Packaging 1: Tape & Reel; Supplier Unit Price 1: $0.10; Supplier Location 1: US
R14 R16 R18 R20 R22 R24 R56 R58 R60 R62#1 R64#1 R66#1 = R_1k_0805: Resistor [SMD]; Manufacturer: Vishay; Manufacturer Part Number: CRCW08051K00FKEAC; Max Power Dissipation: 125mW; Resistance: 1kR; Temperature Coefficient: 100ppm/°C; Tolerance: 1%; Voltage Rating: 150V; ComponentLink1Description: DATASHEET; ComponentLink1URL: https://www.mouser.com/datasheet/2/427/crcwce3-1762584.pdf; ComponentLink2Description: BUY; ComponentLink2URL: https://www.mouser.com/ProductDetail/Vishay-Dale/CRCW08051K00FKEAC?qs=CZ6xfwOSLTXmQIgaYvN%2FBA%3D%3D; Supplier 1: Mouser; Supplier Part Number 1: 71-CRCW08051K00FKEAC; Case Code (Imperial): 0805; Case Code (Metric): 2012; Case/Package: 0805; Contact Plating: Tin; Features: Automotive AEC-Q200,Anti-Sulfur; Height: 0.02inch; Length: 2mm; Max Operating Temperature: 155°C; Min Operating Temperature: -55°C; Number of Terminations: 2; Package Quantity: 5000; Packaging: Tape and Reel; Power Rating: 125mW; Radiation Hardening: No; Resistor Type: Thick Film; RoHS Compliant: Yes; Series: RCA; Termination: Wraparound; Width: 0.049inch; Supplier Packaging 1: Tape & Reel; Supplier Unit Price 1: $0.12; Supplier Location 1: US; Lead Free: Lead Free; Mount: Surface Mount
R25 R27 R29 R31 R33 R35 R67#1 R69 R71 R73 R75 R77 = R_100R_0805: Resistor [SMD]; Manufacturer: Vishay Dale; Manufacturer Part Number: CRCW0805100RFKEAHP; Max Power Dissipation: 500mW; Power Rating: 330mW; Resistance Tolerance: 1%; Temperature Coefficient: 100ppm/°C; Voltage Rating: 150V; ComponentLink1Description: DATASHEET; ComponentLink1URL: https://hr.mouser.com/datasheet/2/427/crcwhpe3-1713858.pdf; ComponentLink2Description: BUY; ComponentLink2URL: https://hr.mouser.com/ProductDetail/Vishay-Dale/CRCW0805100RFKEAHP?qs=sGAEpiMZZMtlubZbdhIBIB2QTI7Ai3WqiihO7cZ%2FwYw%3D; Supplier 1: Mouser; Supplier Part Number 1: 71-CRCW0805100RFKEAH; Case Code (Imperial): 0805; Case Code (Metric): 2012; Case/Package: 0805; Construction: Rectangular; Contact Plating: Tin; Depth: 1.25mm; Features: Automotive AEC-Q200; Height: 0.5mm; Lead Free: Lead Free; Length: 2mm; Max Operating Temperature: 155°C; Military Standard: Not; Min Operating Temperature: -55°C; Mount: Surface Mount; Number of Terminations: 2; Package Quantity: 5000; Packaging: Tape and Reel; Radiation Hardening: No; REACH SVHC: Unknown; Resistance: 100R; Resistor Type: Thick Film; RoHS Compliant: Yes; Series: CRCW-HP; Technology: THICK FILM; Termination: SMD/SMT; Tolerance: 1%; Voltage Rating (DC): 150V; Weight: 0.000194oz; Width: 1.2mm
R26 R28 R30 R32 R34 R36 R68#1 R70 R72 R74 R76 R78 = R_360R_0805: Resistor [SMD]; Manufacturer: Vishay; Manufacturer Part Number: CRCW0805360RFKEA; Max Power Dissipation: 125mW; Number of Terminals/Pins: 2; Temperature Coefficient: 100ppm/°C; Tolerance: 1%; Voltage Rating: 150V; ComponentLink1Description: DATASHEET; ComponentLink1URL: https://hr.mouser.com/datasheet/2/427/dcrcwe3-1762152.pdf; ComponentLink2Description: BUY; ComponentLink2URL: https://hr.mouser.com/ProductDetail/Vishay-Dale/CRCW0805360RFKEA?qs=ofC1ORbyWJdnf1jRDhIDIw%3D%3D; Supplier 1: Mouser; Supplier Part Number 1: 71-CRCW0805360RFKEA; Case Code (Imperial): 0805; Case Code (Metric): 2012; Case/Package: 0805; Contact Plating: Tin; Depth: 1.25mm; Features: Automotive AEC-Q200; Height: 0.45mm; Lead Free: Lead Free; Length: 2mm; Max Operating Temperature: 155°C; Military Standard: Not; Min Operating Temperature: -55°C; Number of Pins: 2; Number of Terminations: 2; Package Quantity: 5000; Packaging: Cut Tape; Power Rating: 125mW; Radiation Hardening: No; REACH SVHC: Unknown; Resistance: 360R; Resistor Type: Thick Film; RoHS Compliant: Yes; Series: D/CRCW E3; Technology: THICK FILM; Termination: SMD/SMT; Voltage Rating (DC): 150V; Weight: 0.000194oz; Width: 1.25mm; Supplier Packaging 1: Tape & Reel; Supplier Unit Price 1: $0.12; Supplier Location 1: US
R37-R42 R79-R84 = R_4k7_0805: Resistor [SMD]; Manufacturer: Vishay; Manufacturer Part Number: CRCW08054K70FKEAC; Power Rating: 125mW; Resistance: 4.7kR; Tolerance: 1%; Temperature Coefficient: 100ppm/°C; ComponentLink1Description: DATASHEET; ComponentLink1URL: https://www.mouser.com/datasheet/2/427/crcwce3-1762584.pdf; ComponentLink2Description: BUY; ComponentLink2URL: https://www.mouser.com/ProductDetail/Vishay-Dale/CRCW08054K70FKEAC?qs=E3Y5ESvWgWOQAAVugewEHA%3D%3D; Case/Package: 0805; Lead Free: Lead Free; RoHS Compliant: Yes; Contact Plating: Tin; Length: 2mm; Max Operating Temperature: 155°C; Min Operating Temperature: -55°C; Mount: Surface Mount; Resistor Type: Thick Film; Termination: Wraparound; Supplier Part Number 1: 71-CRCW08054K70FKEAC; Supplier 1: Mouser